# Altium schematic sheet Busmaster Main.SchDoc
size A2; SheetNumber: 2; SheetTotal: 2
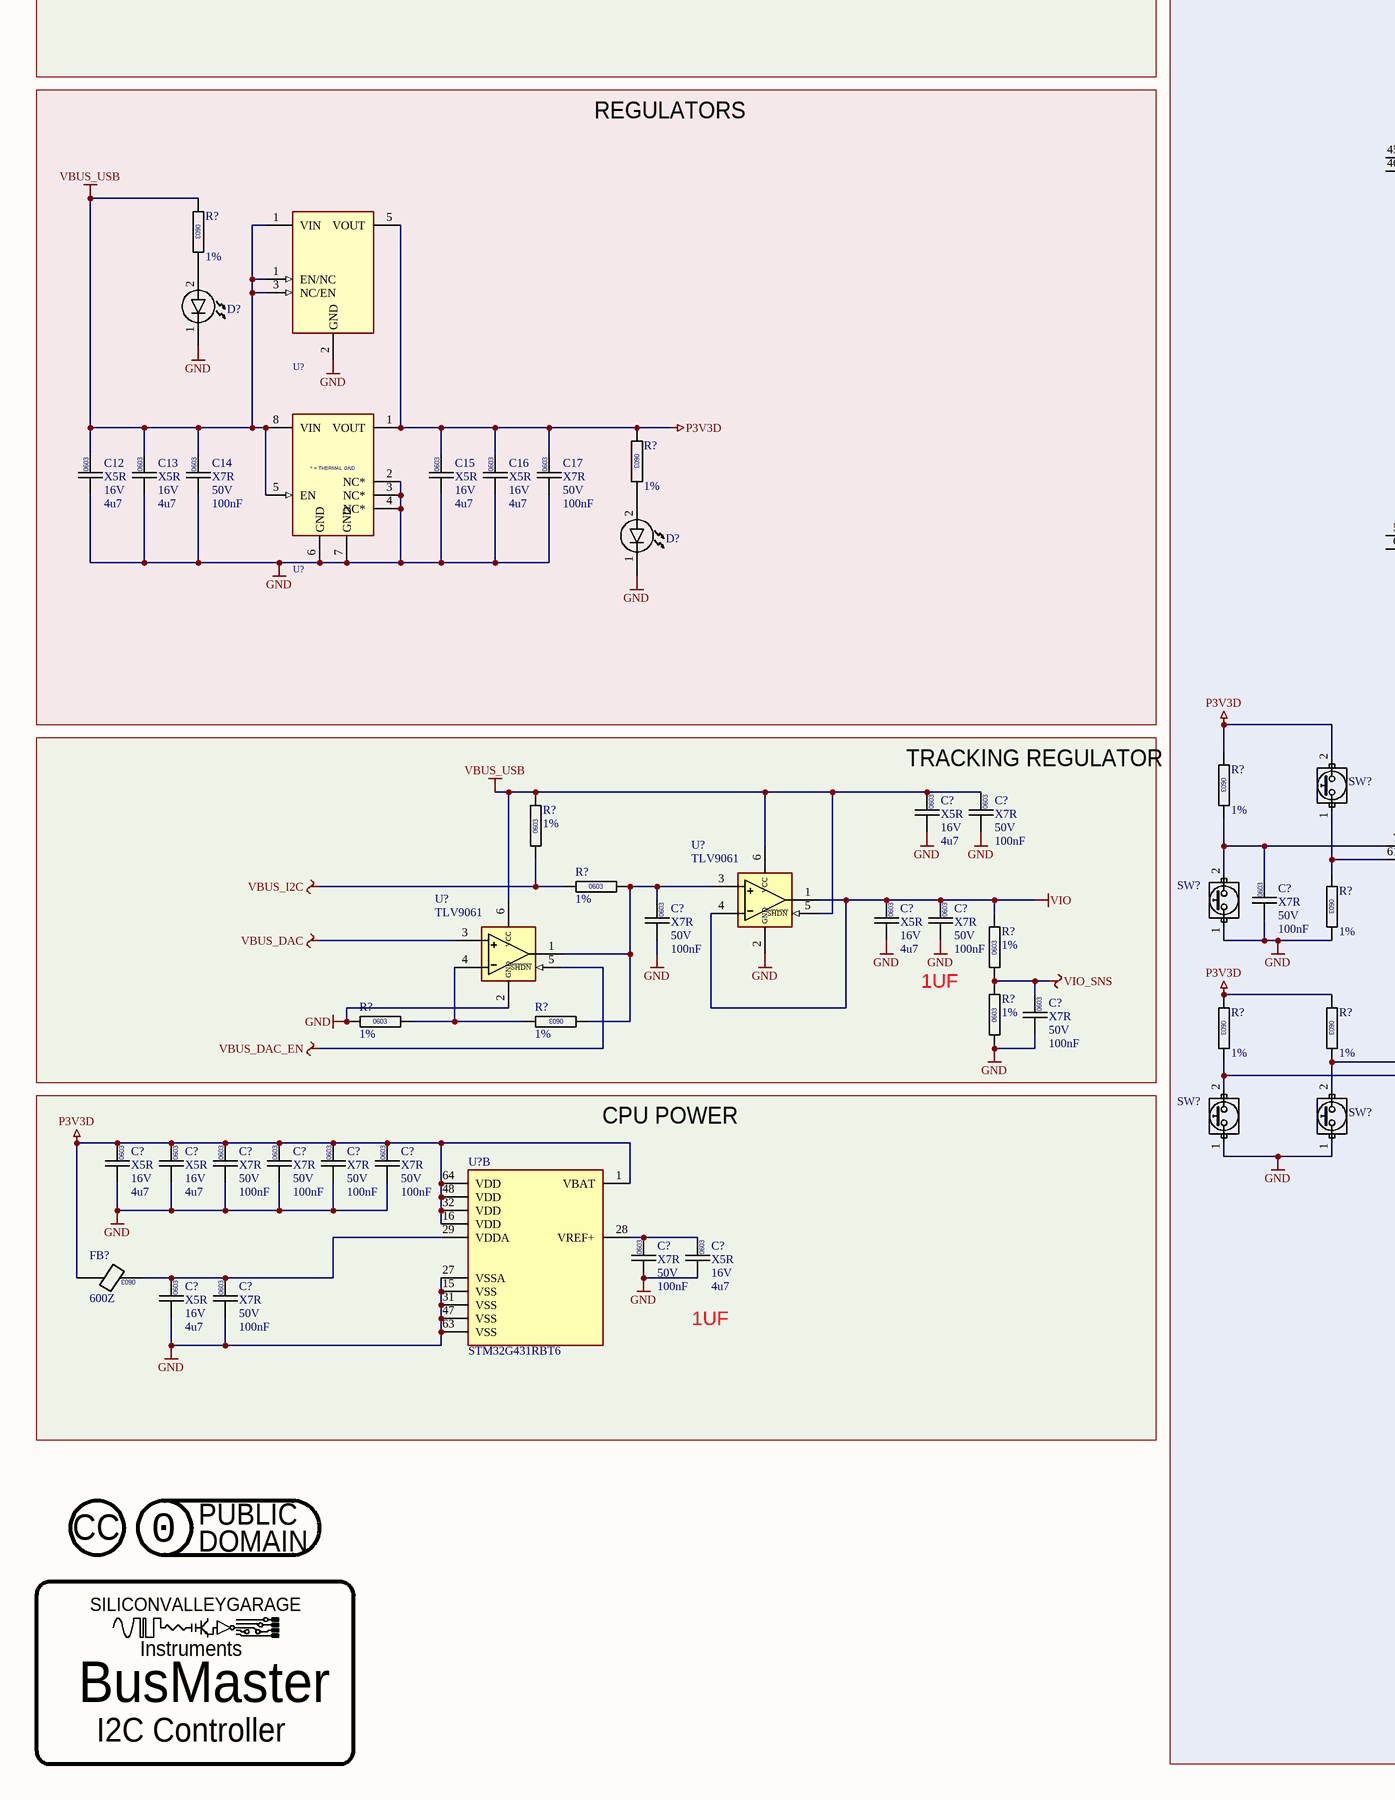
[diagram p0: Busmaster Main.SchDoc, left]
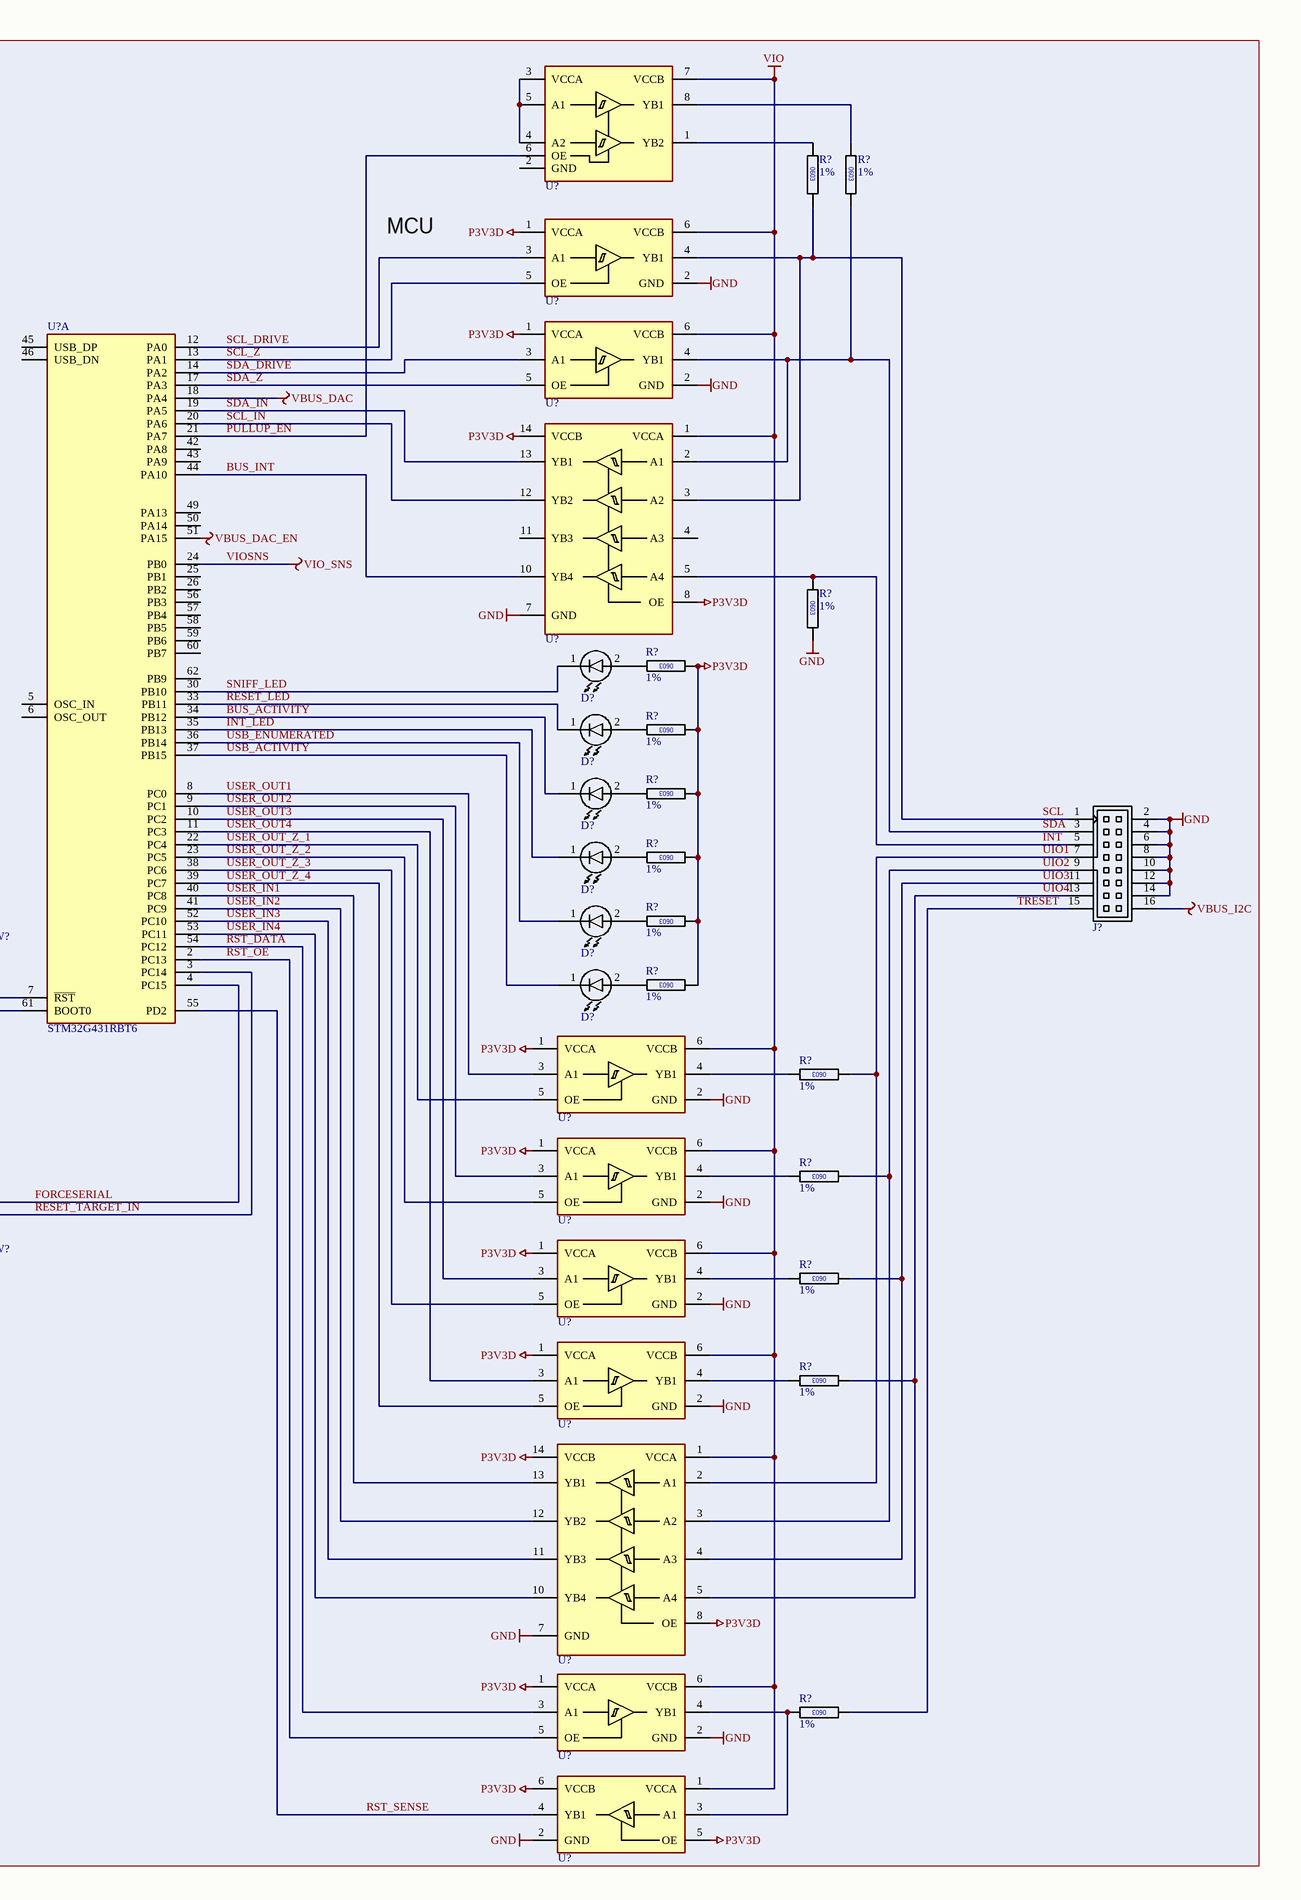
[diagram p1: Busmaster Main.SchDoc, right]

## Parts
(Parts that share a designator on the sheet are numbered #1, #2 ... from top to bottom, then left to right.)
C12  Dielectric: X5R  Voltage: 16V  Capacitance: 4u7  [CAPC0603]  (hidden comment: CAP0603)
C13  Dielectric: X5R  Voltage: 16V  Capacitance: 4u7  [CAPC0603]  (hidden comment: CAP0603)
C14  Dielectric: X7R  Voltage: 50V  Capacitance: 100nF  [CAPC0603]  (hidden comment: CAP0603)
C15  Dielectric: X5R  Voltage: 16V  Capacitance: 4u7  [CAPC0603]  (hidden comment: CAP0603)
C16  Dielectric: X5R  Voltage: 16V  Capacitance: 4u7  [CAPC0603]  (hidden comment: CAP0603)
C17  Dielectric: X7R  Voltage: 50V  Capacitance: 100nF  [CAPC0603]  (hidden comment: CAP0603)
C?#1  Dielectric: X5R  Voltage: 16V  Capacitance: 4u7  [CAPC0603]  (hidden comment: CAP0603)
C?#2  Dielectric: X7R  Voltage: 50V  Capacitance: 100nF  [CAPC0603]  (hidden comment: CAP0603)
C?#3  Dielectric: X7R  Voltage: 50V  Capacitance: 100nF  [CAPC0603]  (hidden comment: CAP0603)
C?#4  Dielectric: X7R  Voltage: 50V  Capacitance: 100nF  [CAPC0603]  (hidden comment: CAP0603)
C?#5  Dielectric: X5R  Voltage: 16V  Capacitance: 4u7  [CAPC0603]  (hidden comment: CAP0603)
C?#6  Dielectric: X7R  Voltage: 50V  Capacitance: 100nF  [CAPC0603]  (hidden comment: CAP0603)
C?#7  Dielectric: X7R  Voltage: 50V  Capacitance: 100nF  [CAPC0603]  (hidden comment: CAP0603)
C?#8  Dielectric: X5R  Voltage: 16V  Capacitance: 4u7  [CAPC0603]  (hidden comment: CAP0603)
C?#9  Dielectric: X5R  Voltage: 16V  Capacitance: 4u7  [CAPC0603]  (hidden comment: CAP0603)
C?#10  Dielectric: X7R  Voltage: 50V  Capacitance: 100nF  [CAPC0603]  (hidden comment: CAP0603)
C?#11  Dielectric: X7R  Voltage: 50V  Capacitance: 100nF  [CAPC0603]  (hidden comment: CAP0603)
C?#12  Dielectric: X7R  Voltage: 50V  Capacitance: 100nF  [CAPC0603]  (hidden comment: CAP0603)
C?#13  Dielectric: X7R  Voltage: 50V  Capacitance: 100nF  [CAPC0603]  (hidden comment: CAP0603)
C?#14  Dielectric: X7R  Voltage: 50V  Capacitance: 100nF  [CAPC0603]  (hidden comment: CAP0603)
C?#15  Dielectric: X5R  Voltage: 16V  Capacitance: 4u7  [CAPC0603]  (hidden comment: CAP0603)
C?#16  Dielectric: X5R  Voltage: 16V  Capacitance: 4u7  [CAPC0603]  (hidden comment: CAP0603)
C?#17  Dielectric: X7R  Voltage: 50V  Capacitance: 100nF  [CAPC0603]  (hidden comment: CAP0603)
D?#1  KT-0603W  [LED-0603-GREEN]  (value not drawn)
D?#2  KT-0603W  [LED-0603-GREEN]  (value not drawn)
D?#3  KT-0603W  [LED-0603-GREEN]  (value not drawn)
D?#4  KT-0603W  [LED-0603-GREEN]  (value not drawn)
D?#5  KT-0603W  [LED-0603-GREEN]  (value not drawn)
D?#6  KT-0603W  [LED-0603-GREEN]  (value not drawn)
D?#7  KT-0603W  [LED-0603-GREEN]  (value not drawn)
D?#8  KT-0603W  [LED-0603-GREEN]  (value not drawn)
FB?  value 600Z  [FB0603]  (hidden comment: FB0603)
J?  BOXHEADER-8X2  [CONNECTOR GENERIC-BOXHEADER-2X10]  (value not drawn)
LOGO1  LOGO-LICENSE-CC0-PUBLIC  [LOGO-LICENSE-CC0-PUBLIC]  (value not drawn)  (no BOM)
LOGO2  LOGO-LICENSE-CC  [LOGO-LICENSE-CC]  (value not drawn)  (no BOM)
LOGO?  LOGO-SILICONVALLEYGARAGE-SMALL  [SILICONVALLEYGARAGE]  (value not drawn)  (graphical)
R?#1  Tolerance: 1%  [RESC0603]  (hidden comment: RESC0603)
R?#2  Tolerance: 1%  [RESC0603]  (hidden comment: RESC0603)
R?#3  Tolerance: 1%  [RESC0603]  (hidden comment: RESC0603)
R?#4  Tolerance: 1%  [RESC0603]  (hidden comment: RESC0603)
R?#5  Tolerance: 1%  [RESC0603]  (hidden comment: RESC0603)
R?#6  Tolerance: 1%  [RESC0603]  (hidden comment: RESC0603)
R?#7  Tolerance: 1%  [RESC0603]  (hidden comment: RESC0603)
R?#8  Tolerance: 1%  [RESC0603]  (hidden comment: RESC0603)
R?#9  Tolerance: 1%  [RESC0603]  (hidden comment: RESC0603)
R?#10  Tolerance: 1%  [RESC0603]  (hidden comment: RESC0603)
R?#11  Tolerance: 1%  [RESC0603]  (hidden comment: RESC0603)
R?#12  Tolerance: 1%  [RESC0603]  (hidden comment: RESC0603)
R?#13  Tolerance: 1%  [RESC0603]  (hidden comment: RESC0603)
R?#14  Tolerance: 1%  [RESC0603]  (hidden comment: RESC0603)
R?#15  Tolerance: 1%  [RESC0603]  (hidden comment: RESC0603)
R?#16  Tolerance: 1%  [RESC0603]  (hidden comment: RESC0603)
R?#17  Tolerance: 1%  [RESC0603]  (hidden comment: RESC0603)
R?#18  Tolerance: 1%  [RESC0603]  (hidden comment: RESC0603)
R?#19  Tolerance: 1%  [RESC0603]  (hidden comment: RESC0603)
R?#20  Tolerance: 1%  [RESC0603]  (hidden comment: RESC0603)
R?#21  Tolerance: 1%  [RESC0603]  (hidden comment: RESC0603)
R?#22  Tolerance: 1%  [RESC0603]  (hidden comment: RESC0603)
R?#23  Tolerance: 1%  [RESC0603]  (hidden comment: RESC0603)
R?#24  Tolerance: 1%  [RESC0603]  (hidden comment: RESC0603)
R?#25  Tolerance: 1%  [RESC0603]  (hidden comment: RESC0603)
R?#26  Tolerance: 1%  [RESC0603]  (hidden comment: RESC0603)
SW?#1  SWITCH-XUNPU-TS-1088-AR02016  [SWITCH-XUNPU-TS-1088-AR02016]  (value not drawn)
SW?#2  SWITCH-XUNPU-TS-1088-AR02016  [SWITCH-XUNPU-TS-1088-AR02016]  (value not drawn)
SW?#3  SWITCH-XUNPU-TS-1088-AR02016  [SWITCH-XUNPU-TS-1088-AR02016]  (value not drawn)
SW?#4  SWITCH-XUNPU-TS-1088-AR02016  [SWITCH-XUNPU-TS-1088-AR02016]  (value not drawn)
U?#1  IC-NXP-NXU0102  (value not drawn)
U?#2  IC-NXP-NXU0101  (value not drawn)
U?#3  IC-NXP-NXU0101  (value not drawn)
U?#4  STM32G431RBT6  (part A of 2)
U?#5  AP7365-18  [SOT-23-5_RoundRect]  (value not drawn)
U?#6  IC-NXP-NXU0104  (value not drawn)
U?#7  AP2112-33  [SOT-23-5_RoundRect]  (value not drawn)
U?#8  TLV9061
U?#9  IC-NXP-NXU0101  (value not drawn)
U?#10  TLV9061
U?#11  IC-NXP-NXU0101  (value not drawn)
U?#12  IC-NXP-NXU0101  (value not drawn)
U?#13  STM32G431RBT6  (part B of 2)
U?#14  IC-NXP-NXU0101  (value not drawn)
U?#15  IC-NXP-NXU0104  (value not drawn)
U?#16  IC-NXP-NXU0101  (value not drawn)
U?#17  IC-NXP-NXU0101  (value not drawn)

## Blocks framed on the sheet
MCU: C?#3 D?#2 D?#3 D?#5-D?#8 J? R?#1 R?#2 R?#4 R?#6-R?#10 R?#12 R?#13 R?#15 R?#16 R?#20 R?#22-R?#26 SW?#1-SW?#4 U?#1-U?#4 U?#6 U?#9 U?#11 U?#12 U?#14-U?#17
REGULATORS: C12-C17 D?#1 D?#4 R?#3 R?#5 U?#5 U?#7
TRACKING REGULATOR: C?#1 C?#2 C?#4-C?#7 R?#11 R?#14 R?#17-R?#19 R?#21 U?#8 U?#10
CPU POWER: C?#8-C?#17 FB? U?#13
BusMaster: LOGO?

## Nets
GND: C12.2 C13.2 C14.2 C15.2 C16.2 C17.2 C?#1.2 C?#2.2 C?#3.2 C?#4.2 C?#5.2 C?#6.2 C?#7.2 C?#8.2 C?#9.2 C?#10.2 C?#11.2 C?#12.2 C?#13.2 C?#14.2 C?#15.2 C?#16.2 C?#17.2 D?#1.1(A) D?#4.1(A) J?.2(-) J?.4(-) J?.6(-) J?.8(-) J?.10(-) J?.12(-) J?.14(-) R?#4.1 R?#16.1 R?#18.1 R?#21.1 SW?#2.1 SW?#3.1 SW?#4.1 U?#2.2(GND) U?#3.2(GND) U?#5.2(GND) U?#6.7(GND) U?#7.2(NC*) U?#7.3(NC*) U?#7.4(NC) U?#7.6(GND) U?#7.7(GND) U?#8.2(GND) U?#9.2(GND) U?#10.2(GND) U?#11.2(GND) U?#12.2(GND) U?#13.15(VSS) U?#13.27(VSSA) U?#13.31(VSS) U?#13.47(VSS) U?#13.63(VSS) U?#14.2(GND) U?#15.7(GND) U?#16.2(GND) U?#17.2(GND)
P3V3D: C15.1 C16.1 C17.1 C?#8.1 C?#9.1 C?#10.1 C?#11.1 C?#12.1 C?#13.1 FB?.2 R?#5.2 R?#6.2 R?#7.2 R?#8.2 R?#9.2 R?#10.2 R?#12.2 R?#13.2 R?#22.2 R?#23.2 SW?#1.2 U?#2.1(VCCA) U?#3.1(VCCA) U?#5.5(VOUT) U?#6.8(OE) U?#6.14(VCCB) U?#7.1(VOUT) U?#9.1(VCCA) U?#11.1(VCCA) U?#12.1(VCCA) U?#13.1(VBAT) U?#13.16(VDD) U?#13.32(VDD) U?#13.48(VDD) U?#13.64(VDD) U?#14.1(VCCA) U?#15.8(OE) U?#15.14(VCCB) U?#16.1(VCCA) U?#17.5(OE) U?#17.6(VCCB)
VBUS_DAC: U?#4.18(PA4) U?#10.3(+)
VBUS_DAC_EN: U?#4.51(PA15) U?#10.5(~{SHDN})
VBUS_I2C: J?.16(-) R?#11.2 R?#14.1
VBUS_USB: C12.1 C13.1 C14.1 C?#1.1 C?#2.1 R?#3.2 R?#11.1 U?#5.1(VIN) U?#5.3(NC/EN) U?#7.5(EN) U?#7.8(VIN) U?#8.5(~{SHDN}) U?#8.6(VCC) U?#10.6(VCC)
VIO: C?#5.1 C?#6.1 R?#17.2 U?#1.7(VCCB) U?#2.6(VCCB) U?#3.6(VCCB) U?#6.1(VCCA) U?#8.1(OUT) U?#8.4(-) U?#9.6(VCCB) U?#11.6(VCCB) U?#12.6(VCCB) U?#14.6(VCCB) U?#15.1(VCCA) U?#16.6(VCCB) U?#17.1(VCCA)
VIOSNS: C?#7.1 R?#17.1 R?#21.2 U?#4.24(PB0)  [also labelled VIO_SNS]
BUS_ACTIVITY: D?#5.1(A) U?#4.34(PB12)
BUS_INT: U?#4.44(PA10) U?#6.10(YB4)
FORCESERIAL: R?#23.1 SW?#4.2 U?#4.4(PC15)
INT: J?.5(-) R?#4.2 U?#6.5(A4)
INT_LED: D?#6.1(A) U?#4.35(PB13)
PULLUP_EN: U?#1.6(OE) U?#4.21(PA7)
RESET_LED: D?#3.1(A) U?#4.33(PB11)
RESET_TARGET_IN: R?#22.1 SW?#3.2 U?#4.3(PC14)
RST_DATA: U?#4.54(PC12) U?#16.3(A1)
RST_OE: U?#4.2(PC13) U?#16.5(OE)
RST_SENSE: U?#4.55(PD2) U?#17.4(YB1)
SCL: J?.1(+) R?#1.1 U?#2.4(YB1) U?#6.3(A2)
SCL_DRIVE: U?#2.3(A1) U?#4.12(PA0)
SCL_IN: U?#4.20(PA6) U?#6.12(YB2)
SCL_Z: U?#2.5(OE) U?#4.13(PA1)
SDA: J?.3(-) R?#2.1 U?#3.4(YB1) U?#6.2(A1)
SDA_DRIVE: U?#3.3(A1) U?#4.14(PA2)
SDA_IN: U?#4.19(PA5) U?#6.13(YB1)
SDA_Z: U?#3.5(OE) U?#4.17(PA3)
SNIFF_LED: D?#2.1(A) U?#4.30(PB10)
TRESET: J?.15(-) R?#26.2
UIO1: J?.7(-) R?#15.2 U?#15.2(A1)
UIO2: J?.9(-) R?#20.2 U?#15.3(A2)
UIO3: J?.11(-) R?#24.2 U?#15.4(A3)
UIO4: J?.13(-) R?#25.2 U?#15.5(A4)
USB_ACTIVITY: D?#8.1(A) U?#4.37(PB15)
USB_ENUMERATED: D?#7.1(A) U?#4.36(PB14)
USER_IN1: U?#4.40(PC8) U?#15.13(YB1)
USER_IN2: U?#4.41(PC9) U?#15.12(YB2)
USER_IN3: U?#4.52(PC10) U?#15.11(YB3)
USER_IN4: U?#4.53(PC11) U?#15.10(YB4)
USER_OUT1: U?#4.8(PC0) U?#9.3(A1)
USER_OUT2: U?#4.9(PC1) U?#11.3(A1)
USER_OUT3: U?#4.10(PC2) U?#12.3(A1)
USER_OUT4: U?#4.11(PC3) U?#14.3(A1)
USER_OUT_Z_1: U?#4.22(PC4) U?#9.5(OE)
USER_OUT_Z_2: U?#4.23(PC5) U?#11.5(OE)
USER_OUT_Z_3: U?#4.38(PC6) U?#12.5(OE)
USER_OUT_Z_4: U?#4.39(PC7) U?#14.5(OE)
NetC?#3_1: C?#3.1 R?#12.1 SW?#2.2 U?#4.7(~{RST})
NetC?#4_1: C?#4.1 R?#14.2 R?#19.1 U?#8.3(+) U?#10.1(OUT)
NetC?#14_1: C?#14.1 C?#15.1 U?#13.28(VREF+)
NetC?#16_1: C?#16.1 C?#17.1 FB?.1 U?#13.29(VDDA)
NetD?#1_2: D?#1.2(K) R?#3.1
NetD?#2_2: D?#2.2(K) R?#6.1
NetD?#3_2: D?#3.2(K) R?#7.1
NetD?#4_2: D?#4.2(K) R?#5.1
NetD?#5_2: D?#5.2(K) R?#8.1
NetD?#6_2: D?#6.2(K) R?#9.1
NetD?#7_2: D?#7.2(K) R?#10.1
NetD?#8_2: D?#8.2(K) R?#13.1
NetR?#1_2: R?#1.2 U?#1.1(YB2)
NetR?#2_2: R?#2.2 U?#1.8(YB1)
NetR?#15_1: R?#15.1 U?#9.4(YB1)
NetR?#16_2: R?#16.2 SW?#1.1 U?#4.61(BOOT0)
NetR?#18_2: R?#18.2 R?#19.2 U?#10.4(-)
NetR?#20_1: R?#20.1 U?#11.4(YB1)
NetR?#24_1: R?#24.1 U?#12.4(YB1)
NetR?#25_1: R?#25.1 U?#14.4(YB1)
NetR?#26_1: R?#26.1 U?#16.4(YB1) U?#17.3(A1)
NetU?#1_3: U?#1.3(VCCA) U?#1.4(A2) U?#1.5(A1)

Not connected (* = marked no-connect by the designer): U?#1 2(GND); U?#4 5(OSC_IN) 6(OSC_OUT) 25(PB1) 26(PB2) 42(PA8) 43(PA9) 45(USB_DP) 46(USB_DN) 49(PA13) 50(PA14) 56(PB3) 57(PB4) 58(PB5) 59(PB6) 60(PB7) 62(PB9); U?#5 4(NC); U?#6 4(A3) 11(YB3)

## Notes on the sheet
- (near R?#17) 1UF
- (near C?#15) 1UF
- (near LOGO?) Instruments
- I2C Controller
- (in symbol FB0603-600Z-0R45) 0603
- (in symbol IC-DIODES-AP2112-SO8) * = THERMAL GND
- (in symbol LOGO-LICENSE-CC) CC
- (in symbol LOGO-LICENSE-CC0-PUBLIC) PUBLIC; 0; DOMAIN
- (in symbol LOGO-SILICONVALLEYGARAGE-SMALL) SILICONVALLEYGARAGE
- (in symbol RESC-0603-4K7-1%-1/10W) 0603

## Library data of the parts
C12 C13 C15 C16 C?#1 C?#5 C?#8 C?#9 C?#15 C?#16 = CAPC-0603-4u7-10V-X5R_1: CAPACITOR,CERAMIC,4u7,16V,X5R,0603; Manufacturer 1: Samsung Electro-Mechanics; Manufacturer Part Number 1: CL10A475KO8NNNC; Package / Case: 0603; Location: *; LCSC: C19666
C14 C17 C?#2-C?#4 C?#6 C?#7 C?#10-C?#14 C?#17 = CAPC-0603-100nF-50V-X7R: CAPACITOR,CERAMIC,100nF,50V,X7R,0603; Manufacturer 1: KEMET; Manufacturer Part Number 1: C0603C104K5RACTU; Package / Case: 0603; Location: *; LCSC: C14663; MOUSER: 80-C0603C104K5R
D?#1-D?#8 = LED-0603-WHITE: LED,SMD,WHITE,42mCd,0603; Manufacturer 1: Hubei KENTO Elec; LCSC: C2290; Manufacturer Part Number 1: KT-0603W
FB? = FB0603-600Z-0R45: FERRITE,600Z@100MHz,0R452DC,0603; Manufacturer 1: SUNLORD; Manufacturer Part Number 1: GZ1608D601TF; LCSC: C1002
J? = CONN-BOXHEADER-8X2: LCSC: C429961
LOGO? = LOGO-SILICONVALLEYGARAGE-SMALL: LOGO,SILICONVALLEYGARAGE,SMALL
R?#1-R?#26 = RESC-0603-4K7-1%-1/10W: RESISTOR,4K7,1%,100mW,0603 (1608); Manufacturer 1: YAGEO; Manufacturer Part Number 1: RC0603FR-074K7L; Location: *; LCSC: C23162; MOUSER: 603-RC0603FR-074K7L
SW?#1-SW?#4 = SWITCH-XUNPU-TS-1088-AR02016: SWITCH,TACT,SMD,2PIN,SMT,TOP ACTUATOR; Manufacturer 1: XUNPU; LCSC: C720477; Manufacturer Part Number 1: TS-1088-AR02016
U?#5 = IC-DIODES-AP2112-SOT89-UNI: LCSC: C460402
U?#7 = IC-DIODES-AP2112-SO8: LCSC: C460402
U?#8 U?#10 = IC-TI-TLV9061